# EAGLE design hw3_pcb (EAGLE 8.1.0)
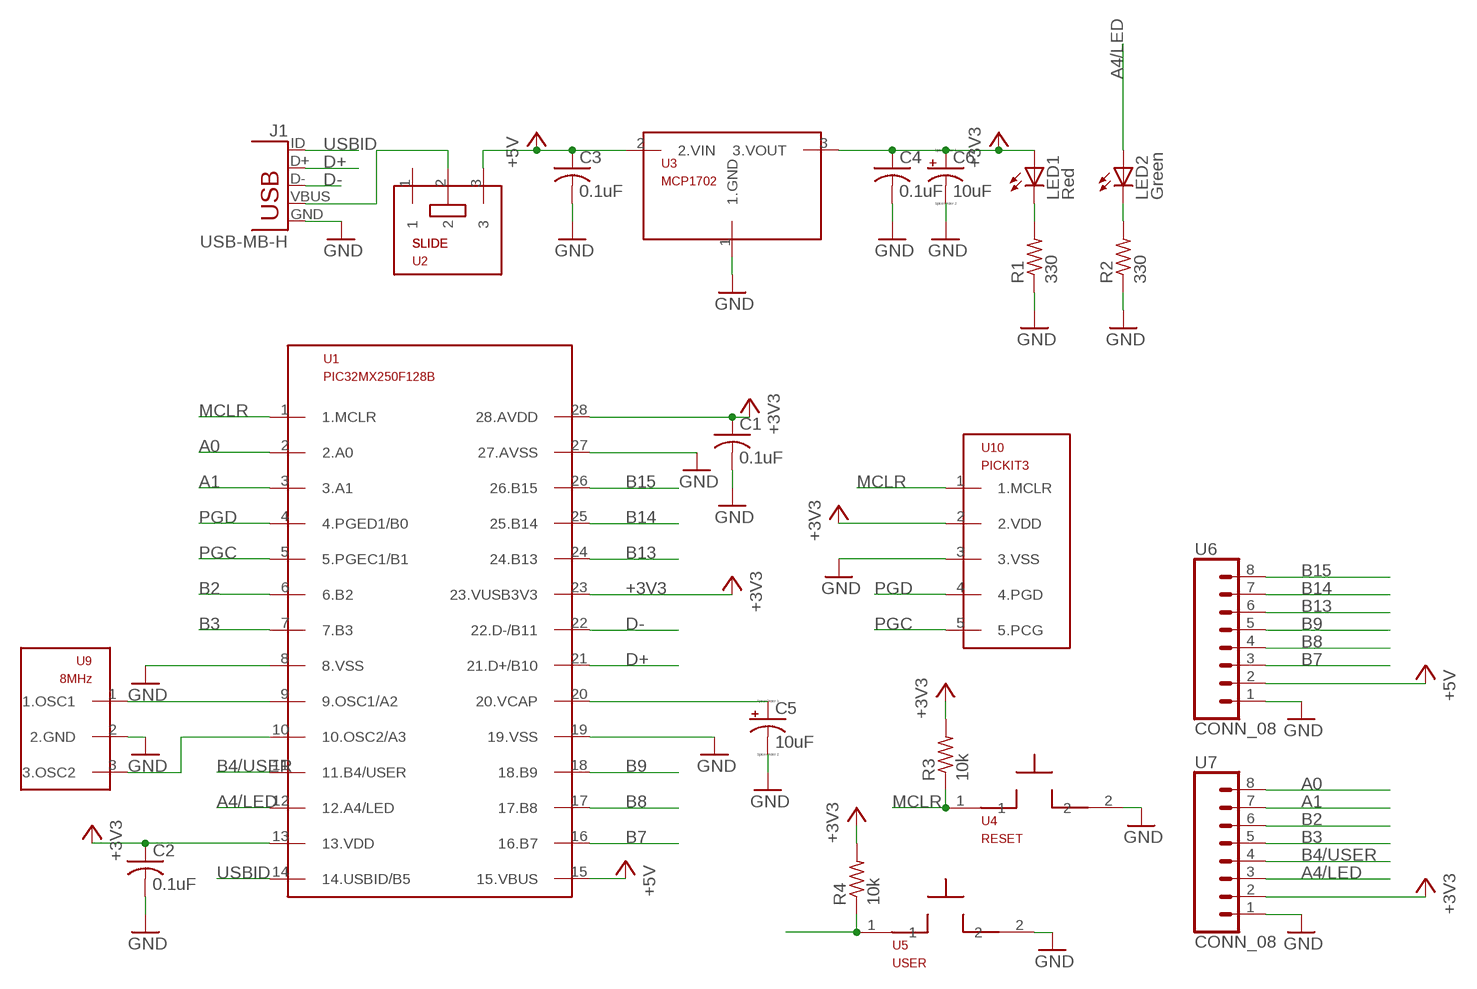
[diagram p0: schematic, sheet 1]

## Parts
C1  0.1uF  C-US025-025X050  [C025-025X050]
C2  0.1uF  C-US025-025X050  [C025-025X050]
C3  0.1uF  C-US025-025X050  [C025-025X050]
C4  0.1uF  C-US025-025X050  [C025-025X050]
C5  10uF  CPOL-USB45181B  [B45181B]
C6  10uF  CPOL-USB45181B  [B45181B]
J1  USB-MB-H  [USB-MB-H]
LED1  Red  LED3MM  [LED3MM]
LED2  Green  LED3MM  [LED3MM]
R1  330  R-US_0207/10  [0207/10]
R2  330  R-US_0207/10  [0207/10]
R3  10k  R-US_0207/10  [0207/10]
R4  10k  R-US_0207/10  [0207/10]
U1  PIC32MX250F128B  [DIL28-3]
U2  SLIDE  [SLIDE]
U3  MCP1702  [TO92]
U4  RESET  PB  [PB]
U5  USER  PB  [PB]
U6  CONN_08  [1X08]
U7  CONN_08  [1X08]
U9  8MHz  OSC  [OSC]
U10  PICKIT3  [1X05]

## Nets
+3V3: C1.1 C2.1 C4.1 C6.+ LED1.A R3.2 R4.2 U1.13(13.VDD) U1.23(23.VUSB3V3) U1.28(28.AVDD) U3.3(3.VOUT) U7.2 U10.2(2.VDD)
+5V: C3.1 U1.15(15.VBUS) U2.3 U3.2(2.VIN) U6.2
A0: U1.2(2.A0) U7.8
A1: U1.3(3.A1) U7.7
A4/LED: LED2.A U1.12(12.A4/LED) U7.3
B2: U1.6(6.B2) U7.6
B3: U1.7(7.B3) U7.5
B4/USER: R4.1 U1.11(11.B4/USER) U5.1 U7.4
B7: U1.16(16.B7) U6.3
B8: U1.17(17.B8) U6.4
B9: U1.18(18.B9) U6.5
B13: U1.24(24.B13) U6.6
B14: U1.25(25.B14) U6.7
B15: U1.26(26.B15) U6.8
D+: J1.D+ U1.21(21.D+/B10)
D-: J1.D- U1.22(22.D-/B11)
GND: C1.2 C2.2 C3.2 C4.2 C5.- C6.- J1.GND R1.1 R2.1 U1.8(8.VSS) U1.19(19.VSS) U1.27(27.AVSS) U3.1(1.GND) U4.2 U5.2 U6.1 U7.1 U9.2(2.GND) U10.3(3.VSS)
MCLR: R3.1 U1.1(1.MCLR) U4.1 U10.1(1.MCLR)
N$1: J1.VBUS U2.2
N$2: LED2.K(C) R2.2
N$4: LED1.K(C) R1.2
OSC1/A2: U1.9(9.OSC1/A2) U9.1(1.OSC1)
OSC2/A3: U1.10(10.OSC2/A3) U9.3(3.OSC2)
PGC: U1.5(5.PGEC1/B1) U10.5(5.PCG)
PGD: U1.4(4.PGED1/B0) U10.4(4.PGD)
USBID: J1.ID U1.14(14.USBID/B5)
VCAP: C5.+ U1.20(20.VCAP)
Unconnected: U2.1

## Library data of the parts
C1-C4 = hw2_pcb:C-US: CAPACITOR, American symbol
C5 C6 = hw2_pcb:CPOL-US: POLARIZED CAPACITOR, American symbol
J1 = hw2_pcb:USB: USB Connectors USB-B-PTH is fully proven SKU : PRT-00139/CONN-08278 USB-miniB is fully proven SKU : PRT-00587 USB-A-PCB is untested. USB-A-H is throughly reviewed, but untested. Spark Fun Electronics SKU : PRT-00437 USB-B-SMT is throughly reviewed, but untested. Needs silkscreen touching up. USB-A-S has not been used/tested USB-MB-H has not been used/tested USB-MICROB has been used. CONN-09505
LED1 LED2 = hw2_pcb:LED: LED OSRAM: - CHIPLED LG R971, LG N971, LY N971, LG Q971, LY Q971, LO R971, LY R971 LH N974, LH R974 LS Q976, LO Q976, LY Q976 LO Q996 - Hyper CHIPLED LW Q18S LB Q993, LB Q99A, LB R99A - SideLED LS A670, LO A670, LY A670, LG A670, LP A670 LB A673, LV A673, LT A673, LW A673 LH A674 LY A675 LS A676, LA A676, LO A676, LY A676, LW A676 LS A679, LY A679, LG A679 - Hyper Micro SIDELED® LS Y876, LA Y876, LO Y876, LY Y876 LT Y87S - SmartLED LW L88C, LW L88S LB L89C, LB L89S, LG L890 LS L89K, LO L89K, LY L89K LS L896, LA L896, LO L896, LY L896 - TOPLED LS T670, LO T670, LY T670, LG T670, LP T670 LSG T670, LSP T670, LSY T670, LOP T670, LYG T670 LG T671, LOG T671, LSG T671 LB T673, LV T673, LT T673, LW T673 LH T674 LS T676, LA T676, LO T676, LY T676, LB T676, LH T676, LSB T676, LW T676 LB T67C, LV T67C, LT T67C, LS T67K, LO T67K, LY T67K, LW E67C LS E67B, LA E67B, LO E67B, LY E67B, LB E67C, LV E67C, LT E67C LW T67C LS T679, LY T679, LG T679 LS T770, LO T770, LY T770, LG T770, LP T770 LB T773, LV T773, LT T773, LW T773 LH T774 LS E675, LA E675, LY E675, LS T675 LS T776, LA T776, LO T776, LY T776, LB T776 LHGB T686 LT T68C, LB T68C - Hyper Mini TOPLED® LB M676 - Mini TOPLED Santana® LG M470 LS M47K, LO M47K, LY M47K Source: http://www.osram.convergy.de LUXEON: - LUMILED® LXK2-PW12-R00, LXK2-PW12-S00, LXK2-PW14-U00, LXK2-PW14-V00 LXK2-PM12-R00, LXK2-PM12-S00, LXK2-PM14-U00 LXK2-PE12-Q00, LXK2-PE12-R00, LXK2-PE12-S00, LXK2-PE14-T00, LXK2-PE14-U00 LXK2-PB12-K00, LXK2-PB12-L00, LXK2-PB12-M00, LXK2-PB14-N00, LXK2-PB14-P00, LXK2-PB14-Q00 LXK2-PR12-L00, LXK2-PR12-M00, LXK2-PR14-Q00, LXK2-PR14-R00 LXK2-PD12-Q00, LXK2-PD12-R00, LXK2-PD12-S00 LXK2-PH12-R00, LXK2-PH12-S00 LXK2-PL12-P00, LXK2-PL12-Q00, LXK2-PL12-R00 Source: www.luxeon.com KINGBRIGHT: KA-3528ASYC Source: www.kingbright.com
R1-R4 = hw2_pcb:R-US_: RESISTOR, American symbol
U1 = hw2_pcb:PIC32MX250F128B
U2 = hw2_pcb:SLIDE
U3 = hw2_pcb:MCP1702
U4 U5 = hw2_pcb:PB
U6 U7 = hw2_pcb:CONN_08
U9 = hw2_pcb:OSC
U10 = hw2_pcb:PICKIT3

## Board
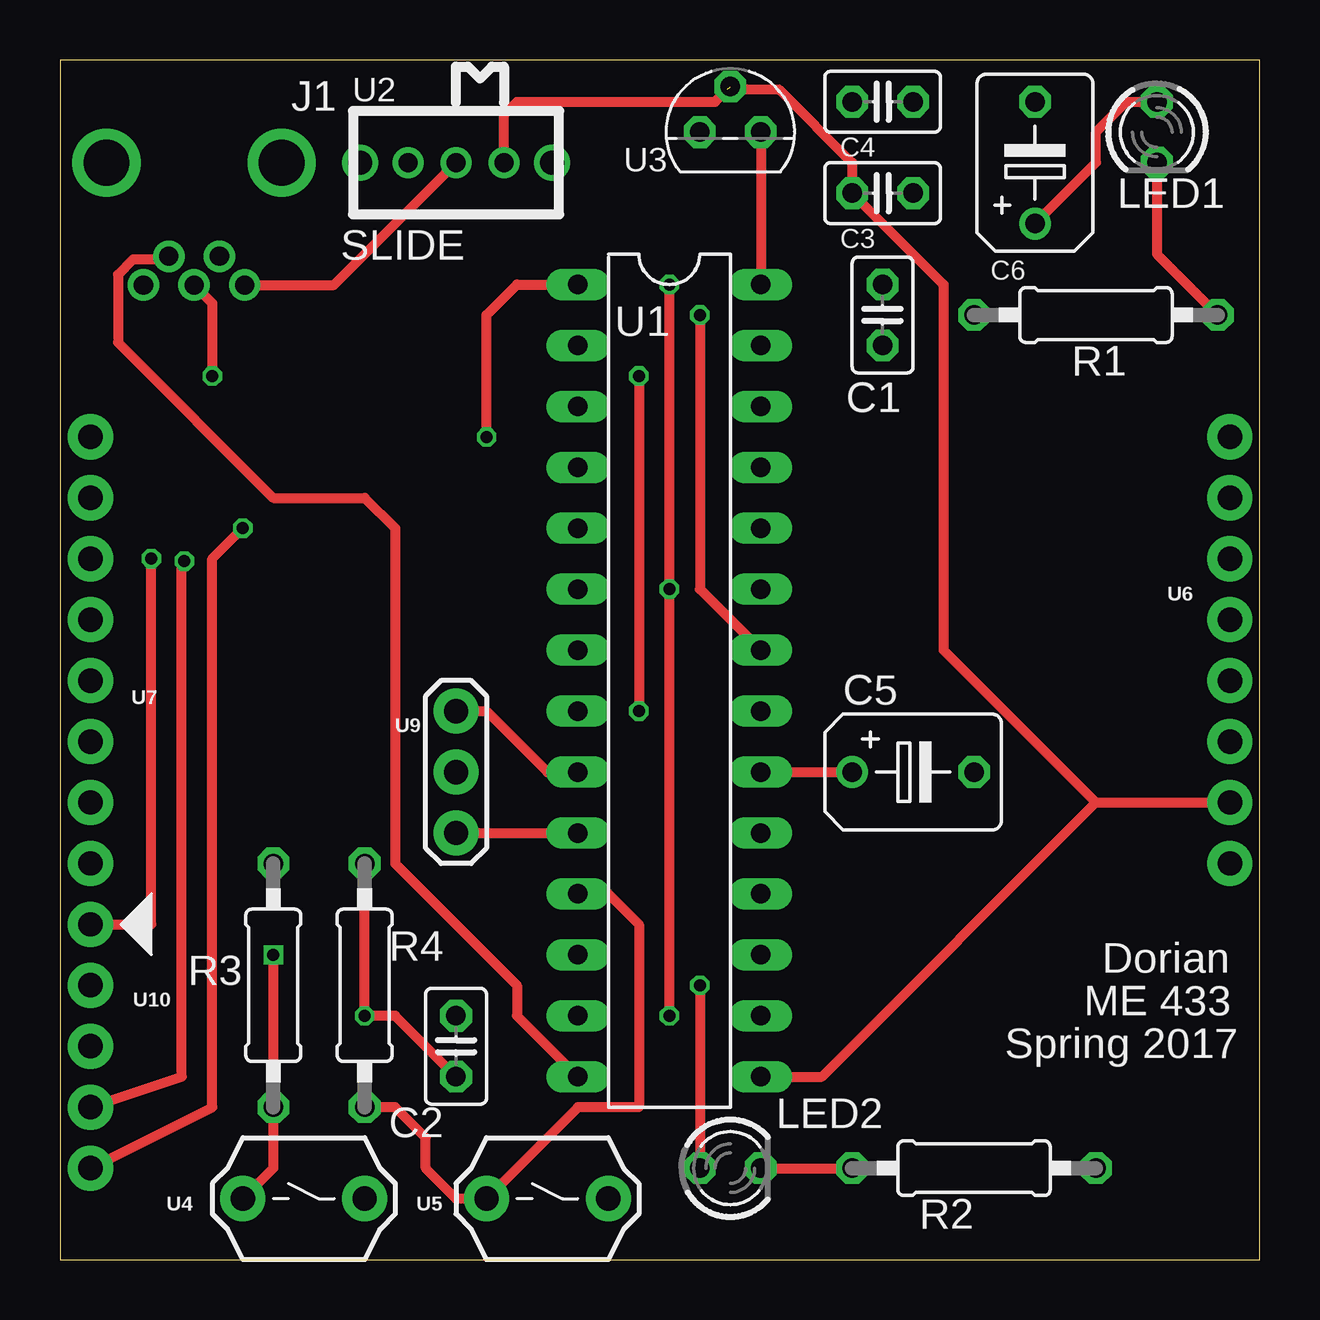
[diagram p1: board, top side]
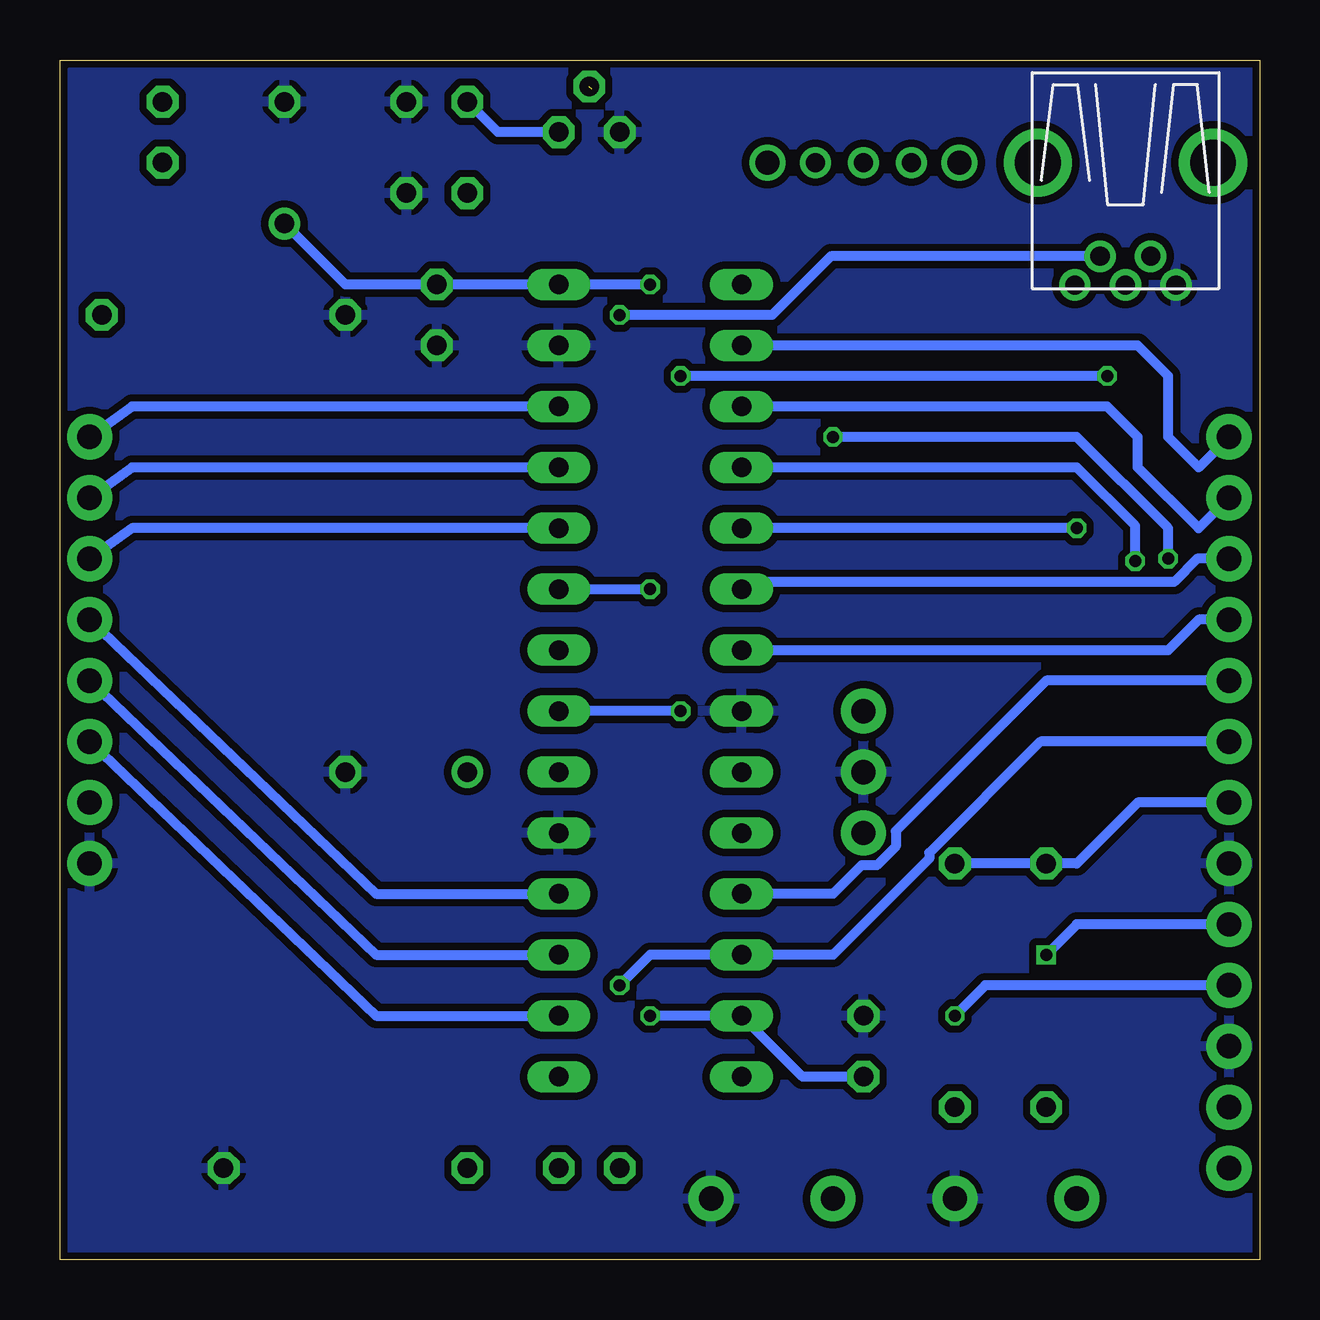
[diagram p2: board, bottom side, seen from below]

Size 50 x 50 mm. Coordinates in mm from the lower left corner, seen from the top.
Outline: 0,0 50,0 50,50 0,50 0,0
Copper layers (1*16): Top 0.035mm / dielectric 1.5mm / Bottom 0.035mm
Design rules "SeeedStudio_2layer_DRU_no_angle_20140221": minimum track width 6mil, minimum drill 12mil, track to track 6mil, track to pad 6mil, pad to pad 6mil, via to via 6mil, smd to smd 0mil, copper to edge 10mil, drill to drill 10mil, minimum pad ring 10mil, minimum via ring 6mil, stop-mask expansion 2mil, vias tented up to drill 100mil, thermal gap 10mil

### Footprints (pad centres in the part's own frame; a part is rotated, then mirrored left to right if it is on the bottom)
C025-025X050 = drill 0.813 octagon: 1 -1.27,0; 2 1.27,0
B45181B = drill 0.813: + -2.54,0 | drill 0.813 octagon: - 2.54,0
USB-MB-H = drill 0.8: D+ 5.1,0; D- 3.9,1.054; GND 5.1,-2.108; ID 3.9,-1.054; VBUS 5.1,2.108 | drill 1.9: P$6 0,-3.65; P$7 0,3.65
LED3MM = drill 0.813 octagon: A -1.27,0; K 1.27,0
0207/10 = drill 0.813 octagon: 1 -5.08,0; 2 5.08,0
DIL28-3 = drill 0.813 long: 1 -16.51,-3.81; 2 -13.97,-3.81; 3 -11.43,-3.81; 4 -8.89,-3.81; 5 -6.35,-3.81; 6 -3.81,-3.81; 7 -1.27,-3.81; 8 1.27,-3.81; 9 3.81,-3.81; 10 6.35,-3.81; 11 8.89,-3.81; 12 11.43,-3.81; 13 13.97,-3.81; 14 16.51,-3.81; 15 16.51,3.81; 16 13.97,3.81; 17 11.43,3.81; 18 8.89,3.81; 19 6.35,3.81; 20 3.81,3.81; 21 1.27,3.81; 22 -1.27,3.81; 23 -3.81,3.81; 24 -6.35,3.81; 25 -8.89,3.81; 26 -11.43,3.81; 27 -13.97,3.81; 28 -16.51,3.81
SLIDE = drill 0.8: 1 -2,0; 2 0,0; 3 2,0 | drill 1: P$1 -4,0; P$2 4,0
TO92 = drill 0.813 octagon: 1 -1.27,0; 2 0,1.905; 3 1.27,0
PB = drill 1.016 pad 1.88: 1 -2.54,0; 2 2.54,0
1X08 = drill 1.016 pad 1.88: 1 0,0; 2 2.54,0; 3 5.08,0; 4 7.62,0; 5 10.16,0; 6 12.7,0; 7 15.24,0; 8 17.78,0
OSC = drill 1.016 pad 1.88: 1 -2.54,0; 2 0,0; 3 2.54,0
1X05 = drill 1.016 pad 1.88: 1 0,0; 2 2.54,0; 3 5.08,0; 4 7.62,0; 5 10.16,0

### Placement (x,y rotation side)
C1  34.29,39.37 270 top
C2  16.51,8.89 90 top
C3  34.29,44.45 0 top
C4  34.29,48.26 0 top
C5  35.56,20.32 0 top
C6  40.64,45.72 90 top
J1  5.59,45.72 270 top
LED1  45.72,46.99 270 top
LED2  27.94,3.81 0 top
R1  43.18,39.37 0 top
R2  38.1,3.81 180 top
R3  8.89,11.43 90 top
R4  12.7,11.43 90 top
U1  25.4,24.13 270 top
U2  16.51,45.72 0 top
U3  27.94,46.99 0 top
U4  10.16,2.54 0 top
U5  20.32,2.54 0 top
U6  48.77,16.51 90 top
U7  1.27,16.51 90 top
U9  16.51,20.32 270 top
U10  1.27,13.97 270 top

### Tracks (layer width: path | path; a pad name or v marks a point on that pad's centre or on a via)
+3V3  (via drill 0.5)
  Top 0.406: v25.4,10.16 v25.4,27.94 v25.4,40.64 | C6.+ 43.18,45.72 43.18,46.99 44.45,48.26 LED1.A | C2.1 13.97,10.16 v12.7,10.16 R4.2 | U3.3 U1.28
  Bottom 0.406: R4.2 R3.2 7.62,16.51 5.08,19.05 U7.2 | v25.4,10.16 U1.13 19.05,7.62 C2.1 | v25.4,40.64 U1.28 C1.1 38.1,40.64 C6.+ | U3.3 31.75,46.99 C4.1 | U1.23 v25.4,27.94 | U10.2 11.43,11.43 v12.7,10.16
+5V  (1 unrouted)
  Top 0.406: U2.3 18.51,47.72 19.05,48.26 27.3,48.26 27.83,48.78 29.96,48.78 33.02,45.72 C3.1 36.83,40.64 36.83,25.4 43.18,19.05 | 43.18,19.05 U6.2 | U1.15 31.75,7.62 43.18,19.05
A0
  Bottom 0.406: U7.8 2.54,33.02 3.81,34.29 3.81,36.83 5.08,38.1 U1.2
A1
  Bottom 0.406: U7.7 2.54,30.48 5.08,33.02 5.08,34.29 6.35,35.56 U1.3
A4/LED  (via drill 0.5)
  Top 0.406: v26.67,11.43 LED2.A
  Bottom 0.406: v26.67,11.43 25.4,12.7 U1.12 17.78,12.7 13.77,16.71 13.77,16.95 9.13,21.59 U7.3
B2
  Bottom 0.406: U7.6 2.59,29.21 3.56,28.25 21.29,28.25 U1.6
B3
  Bottom 0.406: U7.5 2.54,26.67 3.81,25.4 U1.7
B4/USER
  Top 0.406: U1.11 22.86,15.24 24.13,13.97 24.13,6.35 21.59,6.35 U5.1 16.51,2.54 15.24,3.81 15.24,5.08 13.97,6.35 R4.1
  Bottom 0.406: U1.11 17.78,15.24 16.59,16.43 15.95,16.43 15.16,17.22 15.16,17.86 8.89,24.13 U7.4
B7
  Bottom 0.406: U6.3 36.83,10.16 U1.16
B8
  Bottom 0.406: U6.4 36.83,12.7 U1.17
B9
  Bottom 0.406: U6.5 36.83,15.24 U1.18
B13
  Bottom 0.406: U6.6 46.99,30.48 U1.24
B14
  Bottom 0.406: U6.7 46.99,33.02 U1.25
B15
  Bottom 0.406: U6.8 46.99,35.56 U1.26
D+  (via drill 0.5)
  Top 0.406: v24.13,36.83 v24.13,22.86 | J1.D+ 6.35,39.86 v6.35,36.83
  Bottom 0.406: v6.35,36.83 v24.13,36.83 | v24.13,22.86 U1.21
D-  (via drill 0.5)
  Top 0.406: U1.22 26.67,27.94 v26.67,39.37
  Bottom 0.406: J1.D- 17.87,41.82 20.32,39.37 v26.67,39.37
GND
  pour Bottom (isolate 0.305): 0,49.53 0,0 49.53,0 49.53,49.53
MCLR  (via drill 0.5)
  Top 0.406: U10.1 3.81,13.97 v3.81,29.21 | v17.78,34.29 17.78,39.37 19.05,40.64 U1.1 | U4.1 8.89,3.81 R3.1 v8.89,12.7
  Bottom 0.406: v3.81,29.21 3.81,30.48 7.62,34.29 v17.78,34.29 | U10.1 7.62,13.97 v8.89,12.7
N$1
  Top 0.406: J1.VBUS 11.41,40.62 U2.2
N$2
  Top 0.406: LED2.K R2.2
N$4
  Top 0.406: LED1.K 45.72,41.91 R1.2
OSC1/A2
  Top 0.406: U9.1 17.78,22.86 20.32,20.32 U1.9
OSC2/A3
  Top 0.406: U9.3 U1.10
PGC  (via drill 0.5)
  Top 0.406: U10.5 6.35,6.35 6.35,29.21 v7.62,30.48
  Bottom 0.406: v7.62,30.48 U1.5
PGD  (via drill 0.5)
  Top 0.406: U10.4 5.08,7.62 5.08,29.21 v5.19,29.1
  Bottom 0.406: v5.19,29.1 5.19,30.59 7.62,33.02 U1.4
USBID
  Top 0.406: J1.ID 4.14,41.68 3.04,41.68 2.42,41.06 2.42,38.22 8.89,31.75 12.7,31.75 13.97,30.48 13.97,16.51 19.05,11.43 19.05,10.16 U1.14
VCAP
  Top 0.406: U1.20 C5.+

### Text on the board
tPlace: Dorian | ME 433 | Spring 2017